# Altium schematic sheet SAM4s_Schematic.SchDoc: Group 17 Wacky Racer
size A3; DrawnBy: Fraser Rose, Shan Zhong; Address1: ECE Department; Address2: University of Canterbury; Address3: Christchurch 8041; Address4: New Zealand; Revision: 1; SheetNumber: 1; SheetTotal: 2
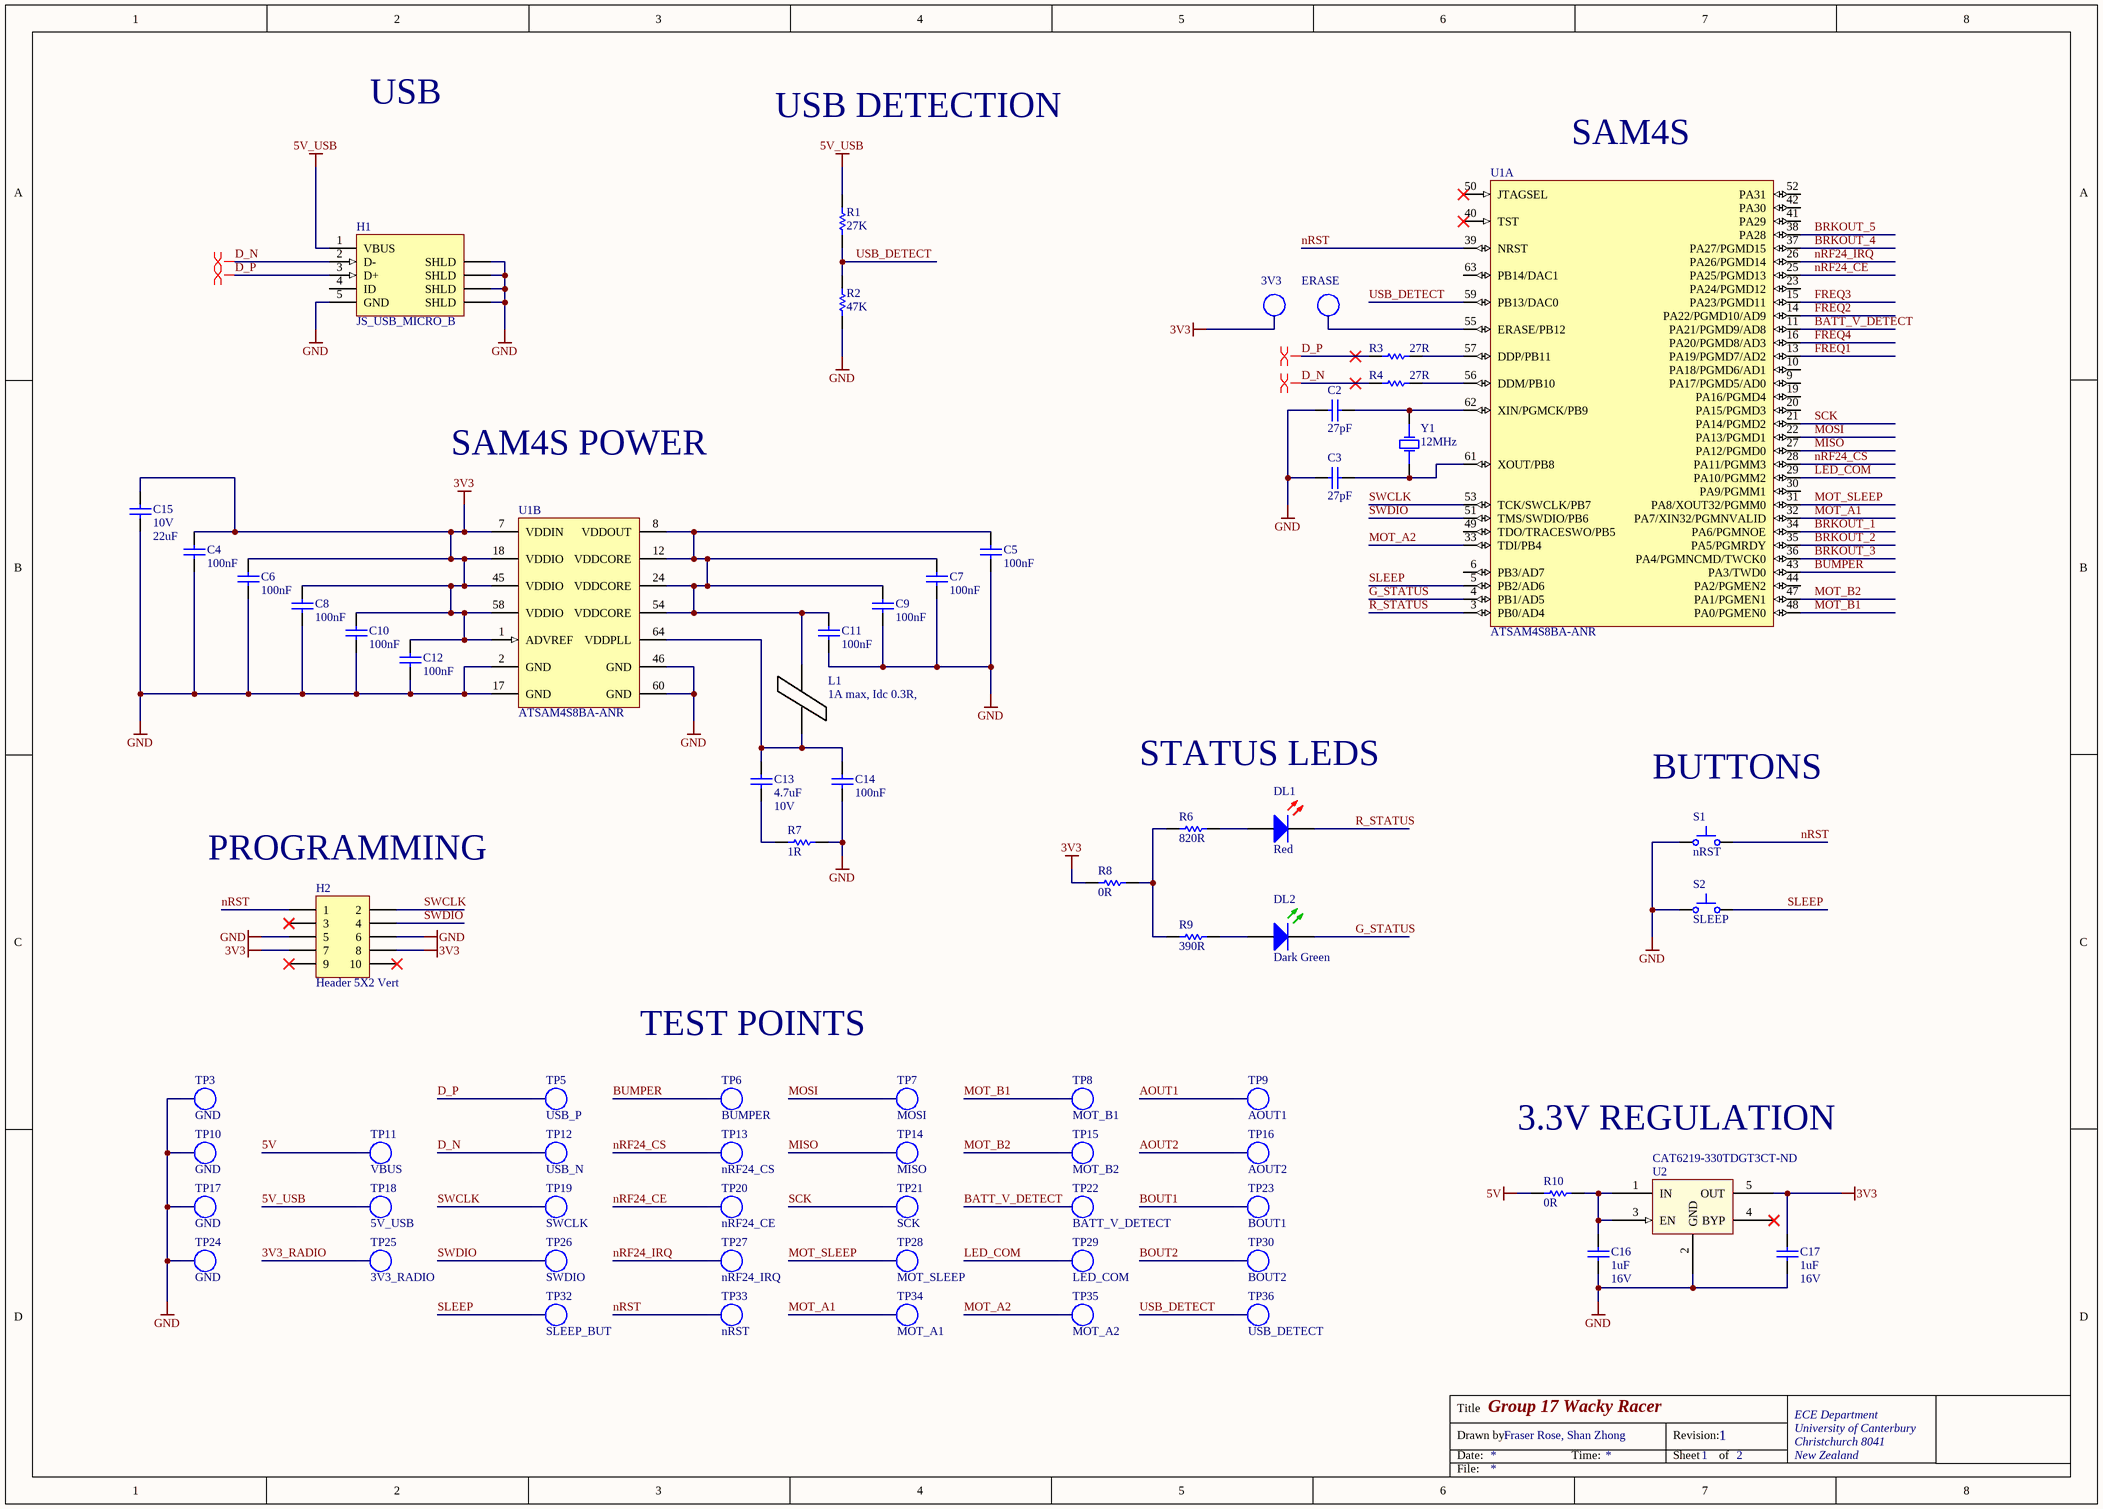
[diagram p0: SAM4s_Schematic.SchDoc]

## Parts
C2  27pF  [CAPC1608N]
C3  27pF  [CAPC1608N]
C4  100nF  [CAPC1608N]
C5  100nF  [CAPC1608N]
C6  100nF  [CAPC1608N]
C7  100nF  [CAPC1608N]
C8  100nF  [CAPC1608N]
C9  100nF  [CAPC1608N]
C10  100nF  [CAPC1608N]
C11  100nF  [CAPC1608N]
C12  100nF  [CAPC1608N]
C13  Max Voltage: 10V  [CAPC1608N]  (hidden comment: 4.7uF)
C14  100nF  [CAPC1608N]
C15  Max Voltage: 10V  [CAPC3216N]  (hidden comment: 22uF)
C16  Max Voltage: 16V  [CAPC1608N]  (hidden comment: 1uF)
C17  Max Voltage: 16V  [CAPC1608N]  (hidden comment: 1uF)
DL1  Red  [WL-SMCW0603]
DL2  Dark Green  [WL-SMCW0603]
H1  JS_USB_MICRO_B  [FCI_USB_10118194-0001LF]
H2  Header 5X2 Vert  [IDC2.54-V10D]
L1  1A max, Idc 0.3R,  [INDC3216N]
R1  27K  [RESC1608N]
R2  47K  [RESC1608N]
R3  27R  [RESC1608N]
R4  27R  [RESC1608N]
R6  820R  [RESC1608N]
R7  1R  [RESC3216N]
R8  0R  [RESC1608N]
R9  390R  [RESC1608N]
R10  0R  [RESC1608N]
S1  nRST  [EVQPNF05M]
S2  SLEEP  [EVQPNF05M]
TP1  3V3  [TP_0603]
TP2  ERASE  [TP_0603]
TP3  GND  [TP_0603]
TP5  USB_P  [TP_0603]
TP6  BUMPER  [TP_0603]
TP7  MOSI  [TP_0603]
TP8  MOT_B1  [TP_0603]
TP9  AOUT1  [TP_0603]
TP10  GND  [TP_0603]
TP11  VBUS  [TP_0603]
TP12  USB_N  [TP_0603]
TP13  nRF24_CS  [TP_0603]
TP14  MISO  [TP_0603]
TP15  MOT_B2  [TP_0603]
TP16  AOUT2  [TP_0603]
TP17  GND  [TP_0603]
TP18  5V_USB  [TP_0603]
TP19  SWCLK  [TP_0603]
TP20  nRF24_CE  [TP_0603]
TP21  SCK  [TP_0603]
TP22  BATT_V_DETECT  [TP_0603]
TP23  BOUT1  [TP_0603]
TP24  GND  [TP_0603]
TP25  3V3_RADIO  [TP_0603]
TP26  SWDIO  [TP_0603]
TP27  nRF24_IRQ  [TP_0603]
TP28  MOT_SLEEP  [TP_0603]
TP29  LED_COM  [TP_0603]
TP30  BOUT2  [TP_0603]
TP32  SLEEP_BUT  [TP_0603]
TP33  nRST  [TP_0603]
TP34  MOT_A1  [TP_0603]
TP35  MOT_A2  [TP_0603]
TP36  USB_DETECT  [TP_0603]
U1  ATSAM4S8BA-ANR  [LQFP64_L]  (parts A,B of 2)
U2  Supplier Part Number: CAT6219-330TDGT3CT-ND  [SOT95P280X145-5N]  (hidden comment: CAT6219-330TDGT3)
Y1  12MHz  [6.0X3.5-4]

## Nets
3V3: C4.2 C6.2 C8.2 C10.2 C12.2 C15.2 C17.2 H2.7 H2.8 R8.2 TP1.1(TP) U1.1(ADVREF) U1.7(VDDIN) U1.18(VDDIO) U1.45(VDDIO) U1.58(VDDIO) U2.5(OUT)
5V: R10.2 TP11.1(TP)
5V_USB: H1.1(VBUS) R1.2 TP18.1(TP)
GND: C2.1 C3.1 C4.1 C5.1 C6.1 C7.1 C8.1 C9.1 C10.1 C11.1 C12.1 C14.1 C15.1 C16.1 C17.1 H1.5(GND) H1.6(SHLD) H2.5 H2.6 R2.1 R7.1 S1.1 S2.1 TP3.1(TP) TP10.1(TP) TP17.1(TP) TP24.1(TP) U1.2(GND) U1.17(GND) U1.46(GND) U1.60(GND) U2.2(GND)
3V3_RADIO: TP25.1(TP)
AOUT1: TP9.1(TP)
AOUT2: TP16.1(TP)
BATT_V_DETECT: TP22.1(TP) U1.11(PA21/PGMD9/AD8)
BOUT1: TP23.1(TP)
BOUT2: TP30.1(TP)
BRKOUT_1: U1.34(PA6/PGMNOE)
BRKOUT_2: U1.35(PA5/PGMRDY)
BRKOUT_3: U1.36(PA4/PGMNCMD/TWCK0)
BRKOUT_4: U1.37(PA27/PGMD15)
BRKOUT_5: U1.38(PA28)
BUMPER: TP6.1(TP) U1.43(PA3/TWD0)
D_N: H1.2(D-) R4.1 TP12.1(TP)
D_P: H1.3(D+) R3.1 TP5.1(TP)
FREQ1: U1.13(PA19/PGMD7/AD2)
FREQ2: U1.14(PA22/PGMD10/AD9)
FREQ3: U1.15(PA23/PGMD11)
FREQ4: U1.16(PA20/PGMD8/AD3)
G_STATUS: DL2.1(K) U1.4(PB1/AD5)
LED_COM: TP29.1(TP) U1.29(PA10/PGMM2)
MISO: TP14.1(TP) U1.27(PA12/PGMD0)
MOSI: TP7.1(TP) U1.22(PA13/PGMD1)
MOT_A1: TP34.1(TP) U1.32(PA7/XIN32/PGMNVALID)
MOT_A2: TP35.1(TP) U1.33(TDI/PB4)
MOT_B1: TP8.1(TP) U1.48(PA0/PGMEN0)
MOT_B2: TP15.1(TP) U1.47(PA1/PGMEN1)
MOT_SLEEP: TP28.1(TP) U1.31(PA8/XOUT32/PGMM0)
nRF24_CE: TP20.1(TP) U1.25(PA25/PGMD13)
nRF24_CS: TP13.1(TP) U1.28(PA11/PGMM3)
nRF24_IRQ: TP27.1(TP) U1.26(PA26/PGMD14)
nRST: H2.1 S1.2 TP33.1(TP) U1.39(NRST)
R_STATUS: DL1.1(K) U1.3(PB0/AD4)
SCK: TP21.1(TP) U1.21(PA14/PGMD2)
SLEEP: S2.2 TP32.1(TP) U1.5(PB2/AD6)
SWCLK: H2.2 TP19.1(TP) U1.53(TCK/SWCLK/PB7)
SWDIO: H2.4 TP26.1(TP) U1.51(TMS/SWDIO/PB6)
USB_DETECT: R1.1 R2.2 TP36.1(TP) U1.59(PB13/DAC0)
NetC2_2: C2.2 U1.62(XIN/PGMCK/PB9) Y1.3(OSC2)
NetC3_2: C3.2 U1.61(XOUT/PB8) Y1.1(OSC1)
NetC5_2: C5.2 C7.2 C9.2 C11.2 L1.2 U1.8(VDDOUT) U1.12(VDDCORE) U1.24(VDDCORE) U1.54(VDDCORE)
NetC13_1: C13.1 R7.2
NetC13_2: C13.2 C14.2 L1.1 U1.64(VDDPLL)
NetC16_2: C16.2 R10.1 U2.1(IN) U2.3(EN)
NetDL1_2: DL1.2(A) R6.1
NetDL2_2: DL2.2(A) R9.2
NetR3_2: R3.2 U1.57(DDP/PB11)
NetR4_2: R4.2 U1.56(DDM/PB10)
NetR6_2: R6.2 R8.1 R9.1
NetTP2_1: TP2.1(TP) U1.55(ERASE/PB12)

Not connected (* = marked no-connect by the designer): H1 4(ID); H2 3* 9* 10*; U1 6(PB3/AD7) 9(PA17/PGMD5/AD0) 10(PA18/PGMD6/AD1) 19(PA16/PGMD4) 20(PA15/PGMD3) 23(PA24/PGMD12) 30(PA9/PGMM1) 40(TST)* 41(PA29) 42(PA30) 44(PA2/PGMEN2) 49(TDO/TRACESWO/PB5) 50(JTAGSEL)* 52(PA31) 63(PB14/DAC1); U2 4(BYP)*

## Layout directives
differential pair: D_N, D_P

## Notes on the sheet
- USB
- USB DETECTION
- (near U1) SAM4S
- SAM4S POWER
- STATUS LEDS
- BUTTONS
- (near H2) PROGRAMMING
- TEST POINTS
- 3.3V REGULATION
- Title
- Drawn by:
- Date:
- Time:
- Revision:
- Sheet
- of
- File:

## Library data of the parts
C2 C3 = CC_27pF_0603: CAP CER 27pF NPO/COG +-5% 50V 0603; PackageReference: 0603; Code_IPC: 1608 [0603]; Verify: *; Supplier: ECE Dept; Storage Location: PCB Assembly WS; Value: 27pF
C4-C12 C14 = CC_100nF_0603: CAP CER 100nF X7R +-10% 50V 0603; PackageReference: 0603; Code_IPC: 1608 [0603]; Verify: *; Supplier: ECE Dept; Storage Location: PCB Assembly WS; Value: 100nF
C13 = CC_4.7uF_0603: CAP CER 4.7uF X5R +-20%  10V 0603; Note: Footprint corresponds to dimensions for bulk cassette packaging. This case size has tightened tolerances.; PackageReference: 0805; Code_IPC: 2012[0805]; Verify: *; Supplier: ECE Dept; Storage Location: PCB Assembly WS; Value: 4.7uF
C15 = CC_22uF_1206: CAP CER 22uF Y5V -20% +80% 10V 1206; Verify: *; Supplier: ECE Dept; Storage Location: PCB Assembly WS; Dielectric: Y5V; Footprint: 1206 (3216 metric); Value: 22uF
C16 C17 = CC_1uF_0603: CAP CER 1uF Y5V -20% +80% 16V 0603; PackageReference: 0603; Code_IPC: 1608 [0603]; Verify: *; Supplier: ECE Dept; Storage Location: PCB Assembly WS; Value: 1uF
DL1 = DL_150060RS75000: LED Red 250mcd 0603 SMD; Manufacturer: WURTH ELEKTRONIK; Forward Current If: 30; Forward Voltage: 2; Lens Shape: Rectangular; Luminous Intensity: 250; Wavelength Typ: 625; Viewing Angle: 140°; LED Mounting: SMD; Supplier 1: Farnell; Supplier Part Number 1: 2322071; Manufacturer Part Number: 150060RS75000; Storage Location: PCB Assembly WS; Supplier: ECE Dept; LED Colour: Red
DL2 = DL_150060GS75000: LED Dk Green 430mcd 0603 SMD; Manufacturer: WURTH ELEKTRONIK; Forward Current If: 30; Wavelength Typ: 520; Forward Voltage: 3.2; Lens Shape: Rectangular; Luminous Intensity: 430; Viewing Angle: 140°; LED Mounting: SMD; Supplier 1: Farnell; Supplier Part Number 1: 2322070; Manufacturer Part Number: 150060GS75000; Storage Location: PCB Assembly WS; Supplier: ECE Dept; LED Colour: Dark Green
H1 = JS_USB_MICRO_B_SMT: CONN USB MICRO B RECPT SMT R/A; Manufacturer: FCI; Manufacturer Part Number: 10118194-0001LF; Gender: Receptacle; Number of Contacts: 5; Specifications: USB 2.0; Supplier 1: Digi-Key; Supplier Part Number 1: 609-4618-1-ND; Features: Shielded, Solder Retention; Mounting Type: Surface Mount, Right Angle, Horizontal
H2 = JA_HDR_IDC_5X2_VERT: IDC Header, 2,54mm, 10-Pin, Vert; Supplier: ECE Dept; Supplier 1: Farnell; Supplier Part Number 1: 1096985; Storage Location: ECE Dept Store
L1 = IN_Ferrite-Bead: Ferrite Bead, Rdc 0.3R, Z100MHZ 600R, Imax 1A, SMD 1206; Manufacturer: FAIR-RITE; Manufacturer PN: 2512066017Y1; DC Current Rating: 1; DC Resistance Max: 0.08; Ferrite Case Style: 1206 ^3216 Metric]; Frequency Range: 50MHz to 1; Impedance: 600; Impedance Tolerance: ± 25%; Supplier: ECE Dept; Storage Location: PCB Assembly WS; Ferrite Mounting: SMD; Supplier 1: Farnell; Supplier Part Number 1: 1612060; Manufacturer Part Number: 2512066017Y1; Value: 1A max, Idc 0.3R,
R1 = RS_27K: RES 27K OHM 1/10W 5% 0603 SMD; Storage Location: PCB Assembly WS; Supplier: ECE Dept; Value: 27K
R2 = RS_47K: RES 47.0K OHM 1/10W 5% 0603 SMD; Storage Location: PCB Assembly WS; Supplier: ECE Dept; Value: 47K
R3 R4 = RS_27R: RES 27 OHM 1/10W 5% 0603 SMD; Storage Location: PCB Assembly WS; Supplier: ECE Dept; Value: 27R
R6 = RS_820R: RES 820 OHM 1/10W 5% 0603 SMD; Storage Location: PCB Assembly WS; Supplier: ECE Dept; Value: 820R
R7 = RT_1R: RES 1R OHM 1/4W 5% 1206 SMD; Storage Location: PCB Assembly WS; Supplier: ECE Dept; Value: 1R
R8 R10 = RS_0R0: RES 0.0 OHM 1/10W 5% 0603 SMD; Storage Location: PCB Assembly WS; Supplier: ECE Dept; Value: 0R
R9 = RS_390R: RES 390 OHM 1/10W 5% 0603 SMD; Storage Location: PCB Assembly WS; Supplier: ECE Dept; Value: 390R
S1 S2 = WS_EVQPNF05M: Panasonic 6 x 3.5mm SMD Light Touch Switch Type SMD; PackageDescription: 6.0 x 3.5 mm; Supplier 1: Farnell; Supplier Part Number 1: 2079481; Manufacturer: Panasonic; Manufacturer PN: EVQPNF05M; Supplier 2: Digi-Key; Supplier Part Number 2: P13598SCT-ND; Storage Location: PCB Assembly WS; Supplier: ECE Dept
TP1-TP3 TP5-TP30 TP32-TP36 = TP_0603: Test Point 1.65X0.9X1.2mm SMD; Manufacturer: TE Connectivity AMP Connectors; Manufacturer Part Number: 1625854-3; Supplier 1: Digi-Key; Mounting Type: Surface Mount; Terminal: 0.063" x 0.031" x 0.045" (1.60mm x 0.80mm x 1.15mm); Type: PC Test Point; Supplier Part Number 1: A106145CT-ND
U1 = SE_ATSAM4S16BA-MU: IC MCU 32BIT 512KB FLASH 64LQFP; Manufacturer: Atmel; Connectivity: I²C, IrDA, Memory Card, SPI, SSC, UART/USART, USB; Core Processor: ARM® Cortex®-M4; Core Size: 32-Bit; Data Converters: A/D 11x12b, D/A 2x12b; Number of I/O: 47; Peripherals: Brown-out Detect/Reset, DMA, POR, PWM, WDT; Program Memory Size: 512KB (512K x 8); RAM Size: 128K x 8; Speed: 120MHz; Voltage - Supply (Vcc/Vdd): 1.62 V ~ 3.6 V; PackageVersion: revJ, Jul-2007; PackageReference: 64PS; PackageDescription: 64-Pin Quad Flat No-Lead (QFN) Sawn, 9 x 9 x 1.0 mm Body, 0.5 mm Pitch, Exposed Pad; Code_JEDEC: MO-220VMMD-3; ComponentLink1Description: Manufacturer URL; ComponentLink1URL: http://www.atmel.com/; ComponentLink2Description: SAM4S Series Datasheet; ComponentLink2URL: http://www.atmel.com/dyn/resources/prod_documents/11100.pdf; ComponentLink3Description: SAM4S Series Summary; ComponentLink3URL: http://www.atmel.com/dyn/resources/prod_documents/11100S.pdf; Supplier 1: Digi-Key; Package / Case: 64-LQFP; Packaging: Cut Tape (CT); Program Memory Type: FLASH; Supplier Part Number 1: ATSAM4S8BA-ANRCT-ND; Manufacturer Part Number: ATSAM4S8BA-ANR
U2 = SV_CAT6219-330TDGT3: IC REG LIN 3.3V 500MA TSOT23-5; Voltage - Input (Max): 5.5V; Voltage Dropout (Max): 0.5V @ 500mA; Manufacturer Part Number: CAT6219-330TDGT3; Base Part Number: CAT6219; Current - Output: 500mA; Package / Case: SOT-23-5 Thin, TSOT-23-5; Supplier: Digi-Key; Supplier Device Package: TSOT-23-5; Voltage - Output (Min/Fixed): 3.3V; ComponentLink1URL: http://www.onsemi.com/pub/Collateral/CAT6219-D.PDF; ComponentLink1Description: http://www.onsemi.com/pub/Collateral/CAT6219-D.PDF; Supplier 1: Digi-Key
Y1 = XT_CRYSTAL_12MHz_18pF: CRYSTAL 12MHZ 18PF 6X3.5mm SMD; Manufacturer: CTS-Frequency Controls; Manufacturer Part Number: 406C35D12M00000; ESR (Equivalent Series Resistance): 60 Ohm; Frequency Stability: ±50ppm; Frequency Tolerance: ±30ppm; Operating Mode: Fundamental; Supplier 1: Digi-Key; Height: 0.047" (1.20mm); Load Capacitance: 18pF; Mounting Type: Surface Mount; Operating Temperature: -20°C ~ 70°C; Package / Case: 4-SMD, No Lead (DFN, LCC); Size / Dimension: 0.236" L x 0.138" W (6.00mm x 3.50mm); Supplier Part Number 1: CTX855CT-ND; Frequency: 12MHz